# Altium schematic sheet Top.SchDoc
size B; Author: E. Sims; Organization: Let's Build Rockets Inc.; SheetNumber: 1; SheetTotal: 2
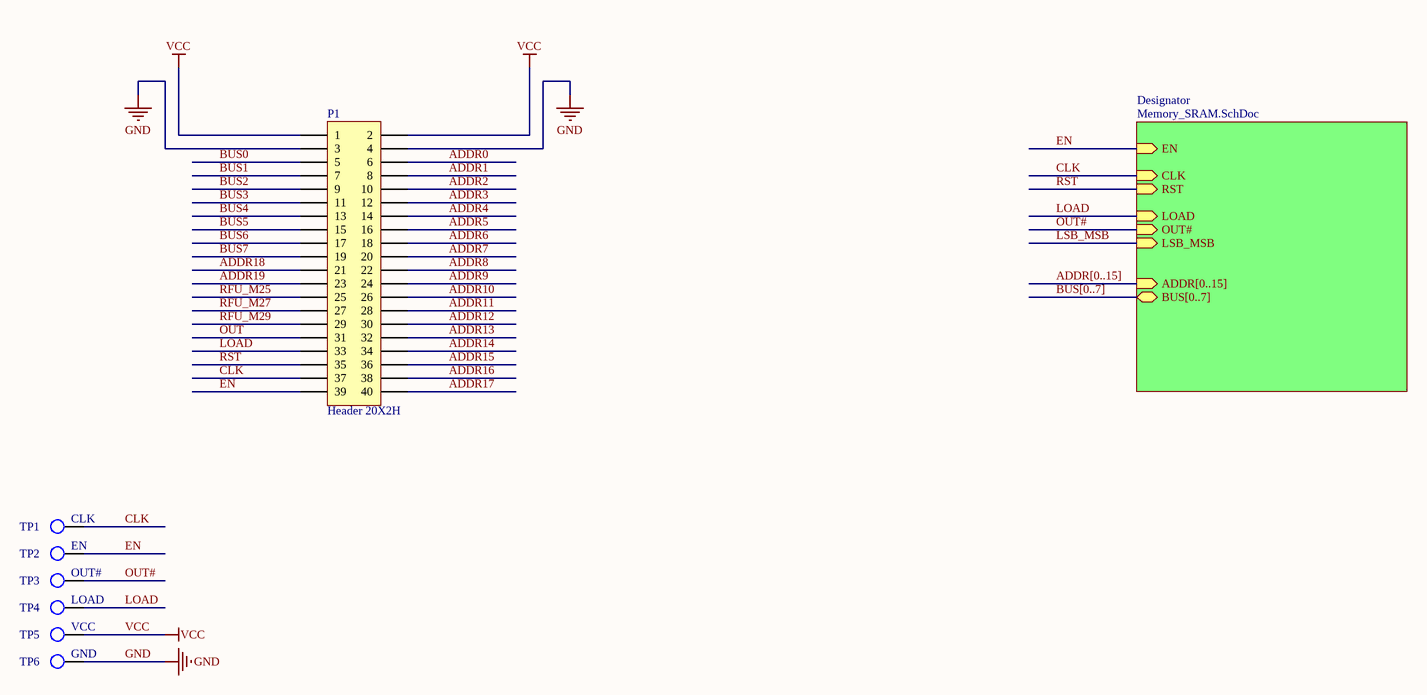
[diagram p0: Top.SchDoc]

## Parts
P1  Header 20X2H  [HDR2X20H]
TP1  CLK  [KSTN-5011_V]  (no BOM)
TP2  EN  [KSTN-5011_V]  (no BOM)
TP3  OUT#  [KSTN-5011_V]  (no BOM)
TP4  LOAD  [KSTN-5011_V]  (no BOM)
TP5  VCC  [KSTN-5011_V]  (no BOM)
TP6  GND  [KSTN-5011_V]  (no BOM)

## Sub-sheets
Designator = Memory_SRAM.SchDoc: LOAD (in), OUT# (in), EN (in), CLK (in), LSB_MSB (in), ADDR[0..15] (in), BUS[0..7] (bidir), RST (in)

## Nets
GND: P1.3 P1.4 TP6.1
VCC: P1.1 P1.2 TP5.1
ADDR0: P1.6
ADDR1: P1.8
ADDR2: P1.10
ADDR3: P1.12
ADDR4: P1.14
ADDR5: P1.16
ADDR6: P1.18
ADDR7: P1.20
ADDR8: P1.22
ADDR9: P1.24
ADDR10: P1.26
ADDR11: P1.28
ADDR12: P1.30
ADDR13: P1.32
ADDR14: P1.34
ADDR15: P1.36
ADDR16: P1.38
ADDR17: P1.40
ADDR18: P1.21
ADDR19: P1.23
BUS0: P1.5
BUS1: P1.7
BUS2: P1.9
BUS3: P1.11
BUS4: P1.13
BUS5: P1.15
BUS6: P1.17
BUS7: P1.19
CLK: P1.37 TP1.1 ; sheet Designator/CLK
EN: P1.39 TP2.1 ; sheet Designator/EN
LOAD: P1.33 TP4.1 ; sheet Designator/LOAD
LSB_MSB: sheet Designator/LSB_MSB
~{OUT}: P1.31
OUT#: TP3.1 ; sheet Designator/OUT#
RFU_M25: P1.25
RFU_M27: P1.27
RFU_M29: P1.29
RST: P1.35 ; sheet Designator/RST

## Buses and harness runs
bus ADDR[0..15] = sheet Designator/ADDR[0..15]
bus BUS[0..7] = sheet Designator/BUS[0..7]

## Notes on the sheet
- Let's Build Rocket's Inc. Modular Paylaod System Based on TMP-010 Rev
  For more information visit https://github.com/LetsBuildRockets/Modular-Payload-System
  This work is licensed under CC BY-NC 4.0. To view a copy of this license, visit https://creativecommons.org/licenses/by-nc/4.0
- Title
- Size:
- Date:
- Assembly Variant:
- B
- Number:
- Time:
- Revision:
- Sheet
- of
- Author:
- File:

## Library data of the parts
P1 = Header 20X2H: Header, 20-Pin, Dual row, Right Angle; System: Connector; LatestRevisionDate: 17-Jul-2002; LatestRevisionNote: Re-released for DXP Platform.; Publisher: Altium Limited
TP1-TP6 = TP